# EAGLE design esp8266_db (EAGLE 7.6.0)
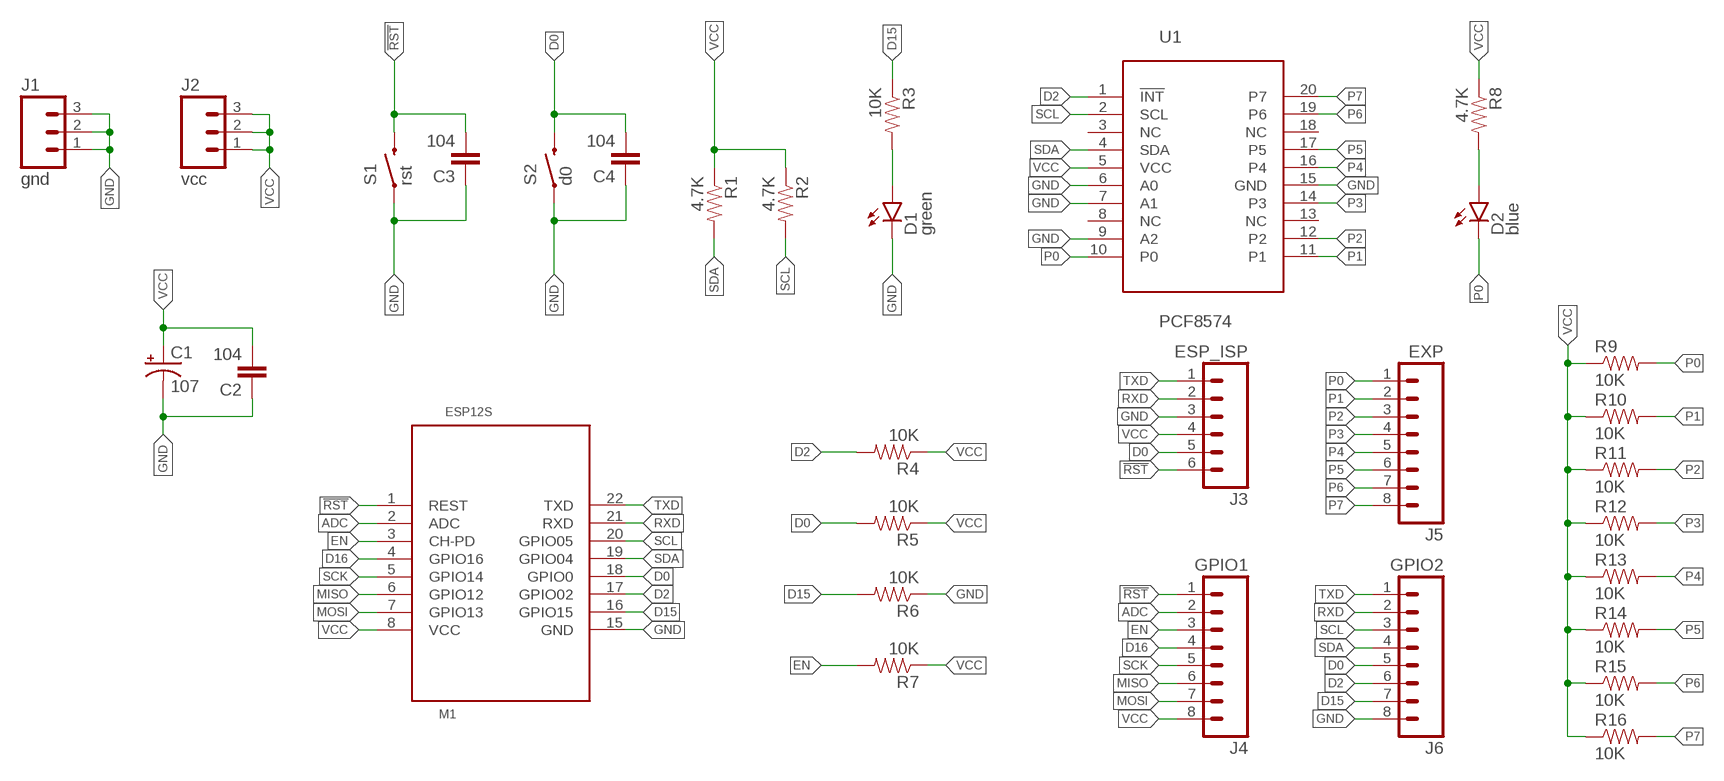
[diagram p0: schematic, sheet 1]

## Parts
C1  107  CAP_POL3528  [EIA3528]
C2  104  CAP0603-CAP  [0603-CAP]
C3  104  CAP0603-CAP  [0603-CAP]
C4  104  CAP0603-CAP  [0603-CAP]
D1  green  LED-EASY  [LED-0603-EASY]
D2  blue  LED-EASY  [LED-0603-EASY]
J1  gnd  M031X03_NO_SILK  [1X03_NO_SILK]
J2  vcc  M031X03_NO_SILK  [1X03_NO_SILK]
J3  ESP_ISP  M06NO_SILK_FEMALE_PTH  [1X06_NO_SILK]
J4  GPIO1  M08NO_SILK_FEMALE_PTH  [1X08_NO_SILK]
J5  EXP  M08NO_SILK_FEMALE_PTH  [1X08_NO_SILK]
J6  GPIO2  M08NO_SILK_FEMALE_PTH  [1X08_NO_SILK]
M1  ESP12S  MODULE-WIFI-ESP8266-12E-SIMPLE  [LGA22-2.0-24X16MM-SIMPLE]
R1  4.7K  RESISTOR0603  [0603-RES]
R2  4.7K  RESISTOR0603  [0603-RES]
R3  10K  RESISTOR0603  [0603-RES]
R4  10K  RESISTOR0603  [0603-RES]
R5  10K  RESISTOR0603  [0603-RES]
R6  10K  RESISTOR0603  [0603-RES]
R7  10K  RESISTOR0603  [0603-RES]
R8  4.7K  RESISTOR0603  [0603-RES]
R9  10K  RESISTOR0603  [0603-RES]
R10  10K  RESISTOR0603  [0603-RES]
R11  10K  RESISTOR0603  [0603-RES]
R12  10K  RESISTOR0603  [0603-RES]
R13  10K  RESISTOR0603  [0603-RES]
R14  10K  RESISTOR0603  [0603-RES]
R15  10K  RESISTOR0603  [0603-RES]
R16  10K  RESISTOR0603  [0603-RES]
S1  rst  SWITCH-MOMENTARY-2PTH  [TACTILE-PTH]
S2  d0  SWITCH-MOMENTARY-2PTH  [TACTILE-PTH]
U1  PCF8574  [TSSOP20]

## Nets
!RST: C3.2 J3.6 J4.1 M1.1(REST) S1.3
ADC: J4.2 M1.2(ADC)
D0: C4.2 J3.5 J6.5 M1.18(GPIO0) R5.2 S2.3
D2: J6.6 M1.17(GPIO02) R4.2 U1.1(!INT)
D15: J6.7 M1.16(GPIO15) R3.1 R6.2
D16: J4.4 M1.4(GPIO16)
EN: J4.3 M1.3(CH-PD) R7.2
GND: C1.C(-) C2.1 C3.1 C4.1 D1.-(C) J1.1 J1.2 J1.3 J3.3 J6.8 M1.15(GND) R6.1 S1.1 S2.1 U1.6(A0) U1.7(A1) U1.9(A2) U1.15(GND)
MISO: J4.6 M1.6(GPIO12)
MOSI: J4.7 M1.7(GPIO13)
N$1: D2.+(A) R8.2
N$4: D1.+(A) R3.2
P0: D2.-(C) J5.1 R9.2 U1.10(P0)
P1: J5.2 R10.2 U1.11(P1)
P2: J5.3 R11.2 U1.12(P2)
P3: J5.4 R12.2 U1.14(P3)
P4: J5.5 R13.2 U1.16(P4)
P5: J5.6 R14.2 U1.17(P5)
P6: J5.7 R15.2 U1.19(P6)
P7: J5.8 R16.2 U1.20(P7)
RXD: J3.2 J6.2 M1.21(RXD)
SCK: J4.5 M1.5(GPIO14)
SCL: J6.3 M1.20(GPIO05) R2.2 U1.2(SCL)
SDA: J6.4 M1.19(GPIO04) R1.2 U1.4(SDA)
TXD: J3.1 J6.1 M1.22(TXD)
VCC: C1.A(+) C2.2 J2.1 J2.2 J2.3 J3.4 J4.8 M1.8(VCC) R1.1 R2.1 R4.1 R5.1 R7.1 R8.1 R9.1 R10.1 R11.1 R12.1 R13.1 R14.1 R15.1 R16.1 U1.5(VCC)
Unconnected: U1.3(NC) U1.8(NC) U1.13(NC) U1.18(NC)

## Library data of the parts
C1 = z_jlc_smt:CAP_POL: Capacitor Polarized These are standard SMD and PTH capacitors. Normally 10uF, 47uF, and 100uF in electrolytic and tantalum varieties. Always verify the external diameter of the through hole cap, it varies with capacity, voltage, and manufacturer. The EIA devices should be standard.
C2-C4 = z_jlc_smt:CAP: Capacitor Standard 0603 ceramic capacitor, and 0.1" leaded capacitor.
D1 D2 = z_jlc_smt:LED: LEDs Standard schematic elements and footprints for 5mm, 3mm, 1206, and 0603 sized LEDs. 5mm - Spark Fun Electronics SKU : COM-00529 (and others)
J1 J2 = SparkFun-Connectors:M03: Header 3 Standard 3-pin 0.1" header. Use with straight break away headers (SKU : PRT-00116), right angle break away headers (PRT-00553), swiss pins (PRT-00743), machine pins (PRT-00117), and female headers (PRT-00115). Molex polarized connector foot print use with SKU : PRT-08232 with associated crimp pins and housings.
J3 = SparkFun-Connectors:M06: Header 6 Standard 6-pin 0.1" header. Use with straight break away headers (SKU : PRT-00116), right angle break away headers (PRT-00553), swiss pins (PRT-00743), machine pins (PRT-00117), and female headers (PRT-00115). Molex polarized connector foot print use with SKU : PRT-08094 with associated crimp pins and housings. NOTES ON THE VARIANTS LOCK and LOCK_LONGPADS... This footprint was designed to help hold the alignment of a through-hole component (i.e. 6-pin header) while soldering it into place. You may notice that each hole has been shifted either up or down by 0.005 of an inch from it's more standard position (which is a perfectly straight line). This slight alteration caused the pins (the squares in the middle) to touch the edges of the holes. Because they are alternating, it causes a "brace" to hold the component in place. 0.005 has proven to be the perfect amount of "off-center" position when using our standard breakaway headers. Although looks a little odd when you look at the bare footprint, once you have a header in there, the alteration is very hard to notice. Also,if you push a header all the way into place, it is covered up entirely on the bottom side. This idea of altering the position of holes to aid alignment will be further integrated into the Sparkfun Library for other footprints. It can help hold any component with 3 or more connection pins.; PROD_ID: CONN-08437
J4-J6 = SparkFun-Connectors:M08: Header 8 Standard 8-pin 0.1" header. Use with straight break away headers (SKU : PRT-00116), right angle break away headers (PRT-00553), swiss pins (PRT-00743), machine pins (PRT-00117), and female headers (PRT-00115).; PROD_ID: CONN-08438
M1 = xmgu2008_modules:MODULE-WIFI-ESP8266-12E-SIMPLE
R1-R16 = z_jlc_smt:RESISTOR: Resistor Basic schematic elements and footprints for 0603, 1206, and PTH resistors.
S1 S2 = xmgu2008:SWITCH-MOMENTARY-2: Various NO switches- pushbuttons, reed, etc; PROD_ID: SWCH-08441
U1 = xmgu2008:PCF8574

## Board
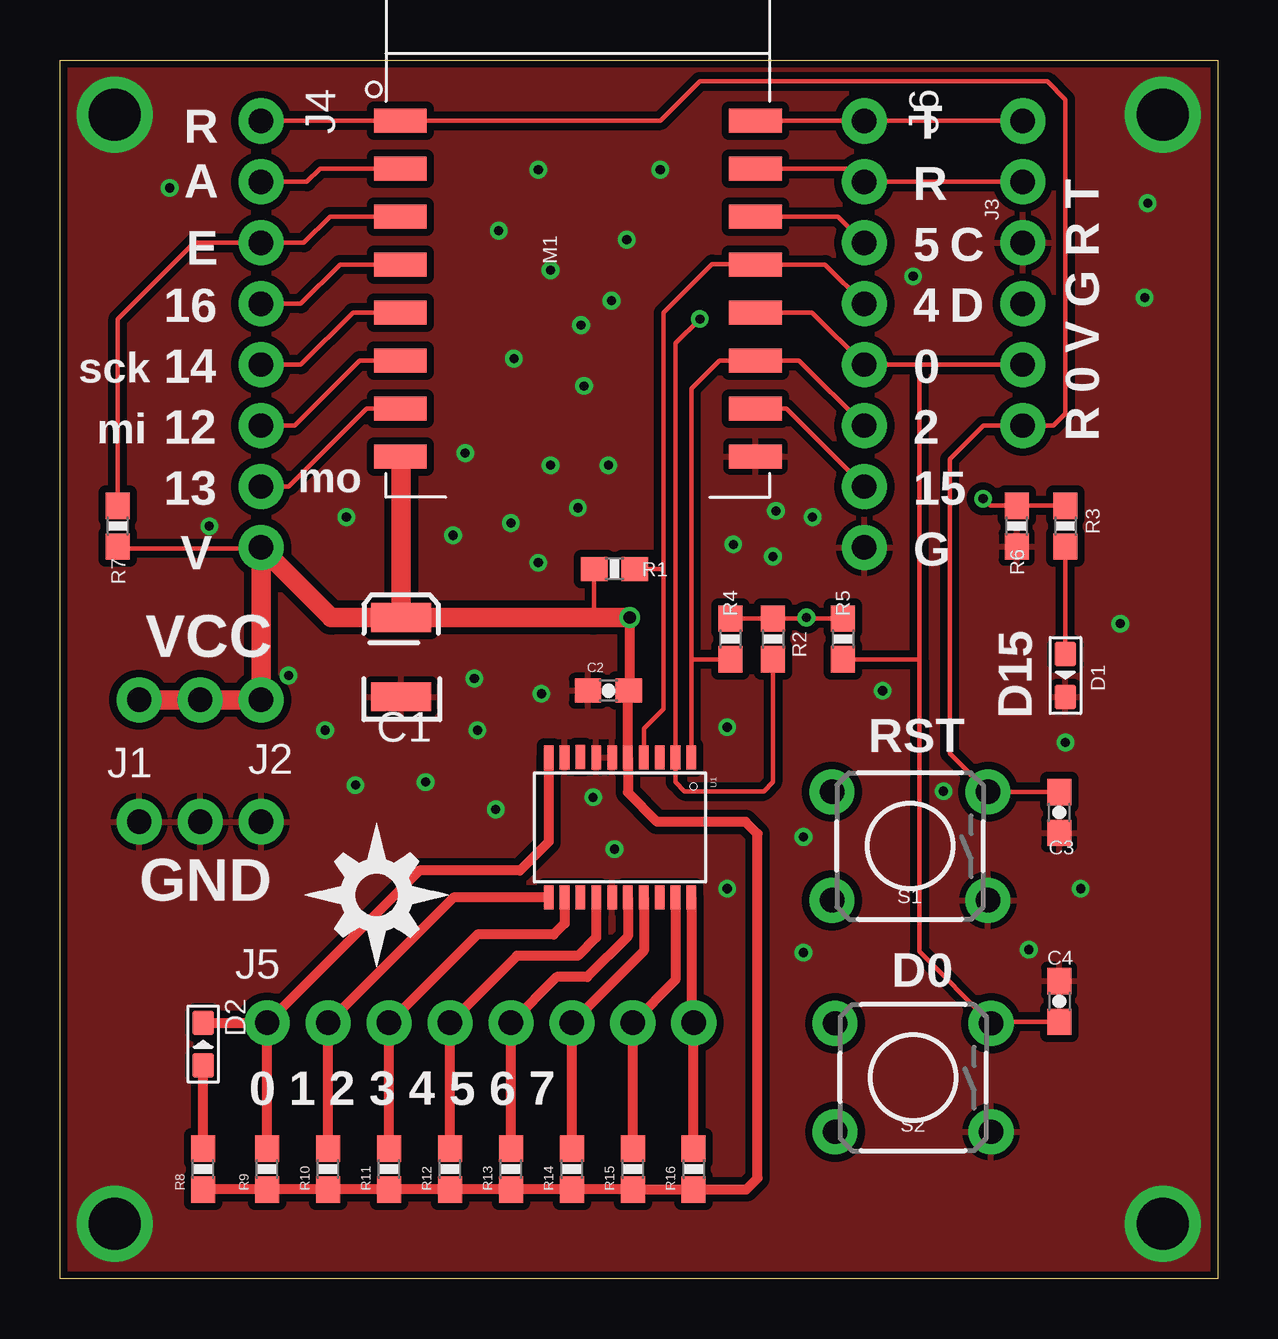
[diagram p1: board, top side]
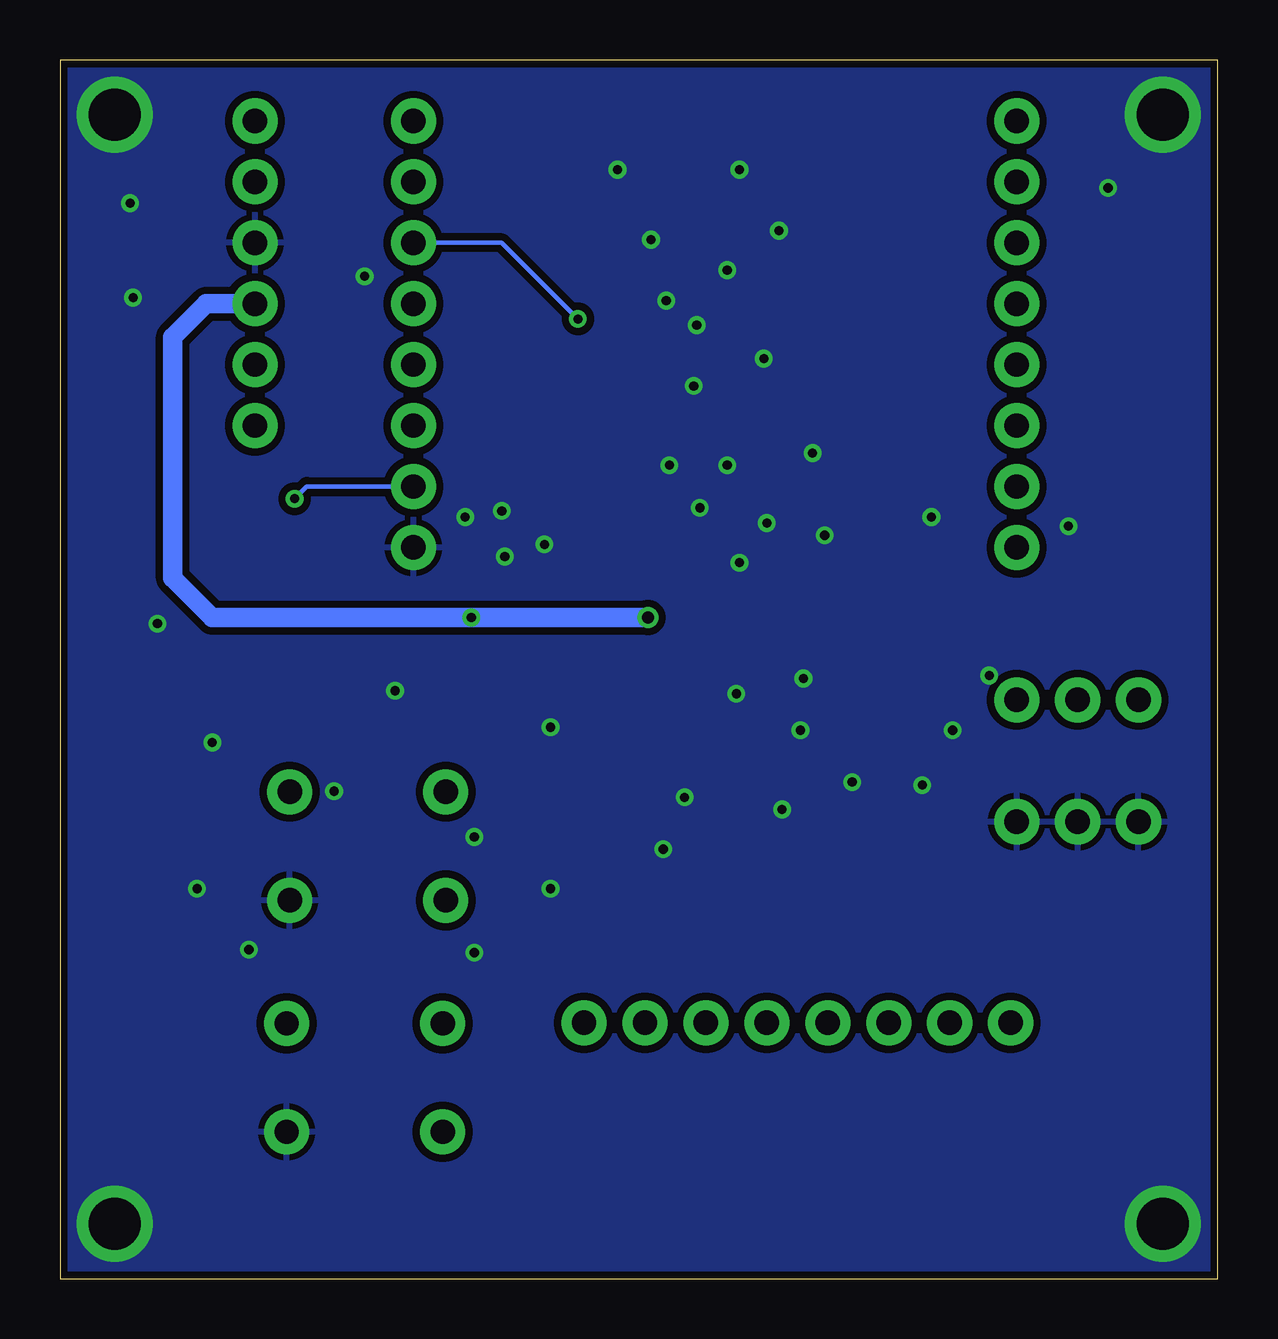
[diagram p2: board, bottom side, seen from below]

Size 48.26 x 50.8 mm. Coordinates in mm from the lower left corner, seen from the top.
Outline: 48.26,0 0,0 0,50.8 48.26,50.8 48.26,0
Copper layers (1*16): Top 0.035mm / dielectric 1.5mm / Bottom 0.035mm
Design rules "SparkFun-2-layer-TIGHT": minimum track width 7mil, minimum drill 15mil, track to track 7mil, track to pad 7mil, pad to pad 7mil, via to via 7mil, smd to smd 7mil, copper to edge 7mil, drill to drill 7mil, minimum pad ring 7mil, minimum via ring 7mil, stop-mask expansion 4mil, vias tented up to drill 20mil, thermal gap 10mil

### Footprints (pad centres in the part's own frame; a part is rotated, then mirrored left to right if it is on the bottom)
EIA3528 = smd 1.2 x 2.5: A 1.65,0; C -1.65,0
0603-CAP = smd 1.1 x 1: 1 -0.85,0; 2 0.85,0
LED-0603-EASY = smd 1.016 x 0.889: + 0.889,0; - -0.889,0
1X03_NO_SILK = drill 1.016 pad 1.88: 1 0,0; 2 2.54,0; 3 5.08,0
1X06_NO_SILK = drill 1.016 pad 1.88: 1 0,0; 2 2.54,0; 3 5.08,0; 4 7.62,0; 5 10.16,0; 6 12.7,0
1X08_NO_SILK = drill 1.016 pad 1.88: 1 0,0; 2 2.54,0; 3 5.08,0; 4 7.62,0; 5 10.16,0; 6 12.7,0; 7 15.24,0; 8 17.78,0
LGA22-2.0-24X16MM-SIMPLE = smd 2.2 x 1: 1 -7.4,3.7; 2 -7.4,1.7; 3 -7.4,-0.3; 4 -7.4,-2.3; 5 -7.4,-4.3; 6 -7.4,-6.3; 7 -7.4,-8.3; 8 -7.4,-10.3; 15 7.4,-10.3; 16 7.4,-8.3; 17 7.4,-6.3; 18 7.4,-4.3; 19 7.4,-2.3; 20 7.4,-0.3; 21 7.4,1.7; 22 7.4,3.7
0603-RES = smd 1.1 x 1: 1 -0.85,0; 2 0.85,0
TACTILE-PTH = drill 1.016 pad 1.88: 1 -3.251,2.261; 2 3.251,2.261; 3 -3.251,-2.261; 4 3.251,-2.261
TSSOP20 = smd 1 x 0.4: 1 -2.937,2.693; 2 -2.937,2.032; 3 -2.937,1.372; 4 -2.937,0.712; 5 -2.937,0.051; 6 -2.937,-0.609; 7 -2.937,-1.27; 8 -2.943,-1.93; 9 -2.937,-2.59; 10 -2.937,-3.251; 11 2.905,-3.251; 12 2.905,-2.59; 13 2.911,-1.93; 14 2.905,-1.27; 15 2.905,-0.609; 16 2.905,0.051; 17 2.905,0.712; 18 2.905,1.372; 19 2.905,2.032; 20 2.905,2.693

### Placement (x,y rotation side)
C1  14.22,25.91 90 top
C2  22.86,24.51 0 top
C3  41.66,19.43 90 top
C4  41.66,11.56 270 top
D1  41.91,25.15 90 top
D2  5.97,9.78 270 top
J1  3.3,19.05 0 top
J2  8.38,24.13 180 top
J3  40.13,48.26 270 top
J4  8.38,48.26 270 top
J5  8.64,10.67 0 top
J6  33.53,48.26 270 top
M1  21.59,44.58 0 top
R1  23.11,29.59 0 top
R2  29.72,26.67 270 top
R3  41.91,31.37 270 top
R4  27.94,26.67 270 top
R5  32.64,26.67 270 top
R6  39.88,31.37 90 top
R7  2.41,31.37 90 top
R8  5.97,4.57 90 top
R9  8.64,4.57 90 top
R10  11.18,4.57 90 top
R11  13.72,4.57 90 top
R12  16.26,4.57 90 top
R13  18.8,4.57 90 top
R14  21.34,4.57 90 top
R15  23.88,4.57 90 top
R16  26.42,4.57 90 top
S1  35.43,18.03 180 top
S2  35.56,8.38 180 top
U1  23.62,18.8 270 top
U$1  [DIYNOVA_LOGO]  10.16,12.95 0 top

### Tracks (layer width: path | path; a pad name or v marks a point on that pad's centre or on a via)
!RST
  Top 0.178: C3.2 38.7,20.28 S1.3 37.08,21.89 37.08,34.16 38.48,35.56 J3.6 41.4,35.56 41.91,36.07 41.91,49.15 41.15,49.91 26.67,49.91 25.04,48.28 M1.1 8.4,48.28 J4.1
ADC
  Top 0.178: M1.2 10.84,46.28 10.29,45.72 J4.2
D0
  Top 0.178: M1.18 31.35,40.28 J6.5 35.81,38.1 | 35.81,25.78 35.81,13.64 S2.3 38.88,10.71 C4.2 | R5.2 35.77,25.82 35.81,25.78 | 35.81,38.1 J3.5 | 35.81,25.78 35.81,38.1
D2
  Top 0.178: J6.6 30.81,38.28 M1.17 27.48,38.28 26.32,37.11 26.32,25.78 | U1.1 26.32,25.78 | R4.2 26.35,25.82 26.32,25.78
D15  (via drill 0.38)
  Top 0.178: M1.16 30.27,36.28 J6.7 | R3.1 R6.2 38.77,32.22 v38.48,32.51
  Bottom 0.178: v38.48,32.51 37.97,33.02 J6.7
D16
  Top 0.178: M1.4 11.67,42.28 10.03,40.64 J4.4
EN
  Top 0.178: M1.3 11.26,44.28 10.16,43.18 J4.3 5.59,43.18 2.41,40.01 R7.2
GND  (via drill 0.38, 2.16)
  other vias: 20.45,33.91 18.8,31.5 16.38,30.99 11.94,31.75 16.89,34.42 21.59,32.13 19.94,29.84 22.86,33.91 18.92,38.35 20.45,42.04 21.72,39.75 22.99,40.77 23.62,43.31 18.29,43.69 19.94,46.23 25.02,46.23 21.84,37.21 28.07,30.61 29.84,32 29.72,30.1 31.37,31.75 34.29,24.51 36.83,20.32 35.56,41.78 45.34,44.83 45.21,40.89 44.2,27.3 41.91,22.35 42.55,16.26 40.39,13.72 30.99,13.59 27.81,16.26 23.11,17.91 18.16,19.56 17.27,25.02 17.4,22.86 15.24,20.7 12.32,20.57 11.05,22.86 9.53,25.15 6.22,31.37 4.57,45.47 2.29,2.29 2.29,48.51 45.97,48.51 45.97,2.29 27.81,22.99 20.07,24.38 22.23,20.07 30.99,18.41
  pour Bottom (isolate 0.305): 48.26,0 0,0 0,50.8 48.26,50.8
  pour Top (isolate 0.305, rank 3): 48.26,0 0,0 0,50.8 48.26,50.8
MISO
  Top 0.178: M1.6 12.5,38.28 9.78,35.56 J4.6
MOSI
  Top 0.178: M1.7 12.78,36.28 9.53,33.02 J4.7
N$1
  Top 0.406: R8.2 D2.+
N$4
  Top 0.178: D1.+ R3.2
P0
  Top 0.406: U1.10 20.37,18.21 19.18,17.02 14.99,17.02 J5.1 | R9.2 J5.1 | D2.- J5.1
P1
  Top 0.406: U1.11 16.4,15.89 J5.2 R10.2
P2
  Top 0.406: U1.12 21.03,14.81 20.57,14.35 17.4,14.35 J5.3 R11.2
P3
  Top 0.406: U1.14 22.35,14.22 21.59,13.46 19.05,13.46 J5.4 R12.2
P4
  Top 0.406: U1.16 23.67,14.28 21.97,12.57 20.7,12.57 J5.5 R13.2
P5
  Top 0.406: U1.17 24.33,13.67 J5.6 R14.2
P6
  Top 0.406: U1.19 25.65,12.45 J5.7 R15.2
P7
  Top 0.406: U1.20 26.32,10.77 J5.8 R16.2
RXD
  Top 0.178: M1.21 32.97,46.28 J6.2 J3.2
SCK
  Top 0.178: M1.5 12.21,40.28 10.03,38.1 J4.5
SCL  (via drill 0.38)
  Top 0.178: M1.20 32.43,44.28 J6.3 | v26.67,40.01 25.65,38.99 U1.2 25.65,20.7 26.04,20.32 29.34,20.32 29.72,20.7 R2.2
  Bottom 0.178: v26.67,40.01 29.84,43.18 J6.3
SDA
  Top 0.178: J6.4 31.89,42.28 M1.19 28.98,42.29 27.18,42.29 25.15,40.26 25.15,29.59 | U1.4 24.33,22.94 25.15,23.75 25.15,29.59 | R1.2 25.15,29.59
TXD
  Top 0.178: M1.22 33.51,48.28 J6.1 J3.1
VCC  (via drill 0.38, 0.51)
  Top 0.178: J4.8 8.34,30.44 2.49,30.44 R7.1 | R4.1 R2.1 31.08,27.52 v31.11,27.56 31.15,27.52 R5.1 | R1.1 22.26,27.6 22.23,27.56
  Top 0.406: v23.75,27.56 23.75,24.55 C2.2 23.67,24.47 U1.5 23.67,20.27 24.89,19.05 28.57,19.05 29.08,18.54 29.08,4.19 28.61,3.72 R16.1 R15.1 R14.1 R13.1 R12.1 R11.1 R10.1 R9.1 R8.1
  Top 0.813: M1.8 14.22,34.24 C1.A | v23.75,27.56 22.23,27.56 C1.A | J2.3 J2.2 J2.1 J4.8 11.31,27.55 11.31,27.56 C1.A
  Bottom 0.813: J3.4 42.16,40.64 43.56,39.24 43.56,29.21 41.91,27.56 v31.11,27.56 v23.75,27.56

### Text on the board
tPlace: R | T | A | R | E | 5 | C | 16 | 4 | D | sck | 14 | 0 | mi | 12 | 2 | R 0 V G R T | mo | 13 | 15 | V | G | VCC | RST | D15 | GND | D0 | 0 1 2 3 4 5 6 7